# EAGLE design JTagAdapter (EAGLE 5.09)
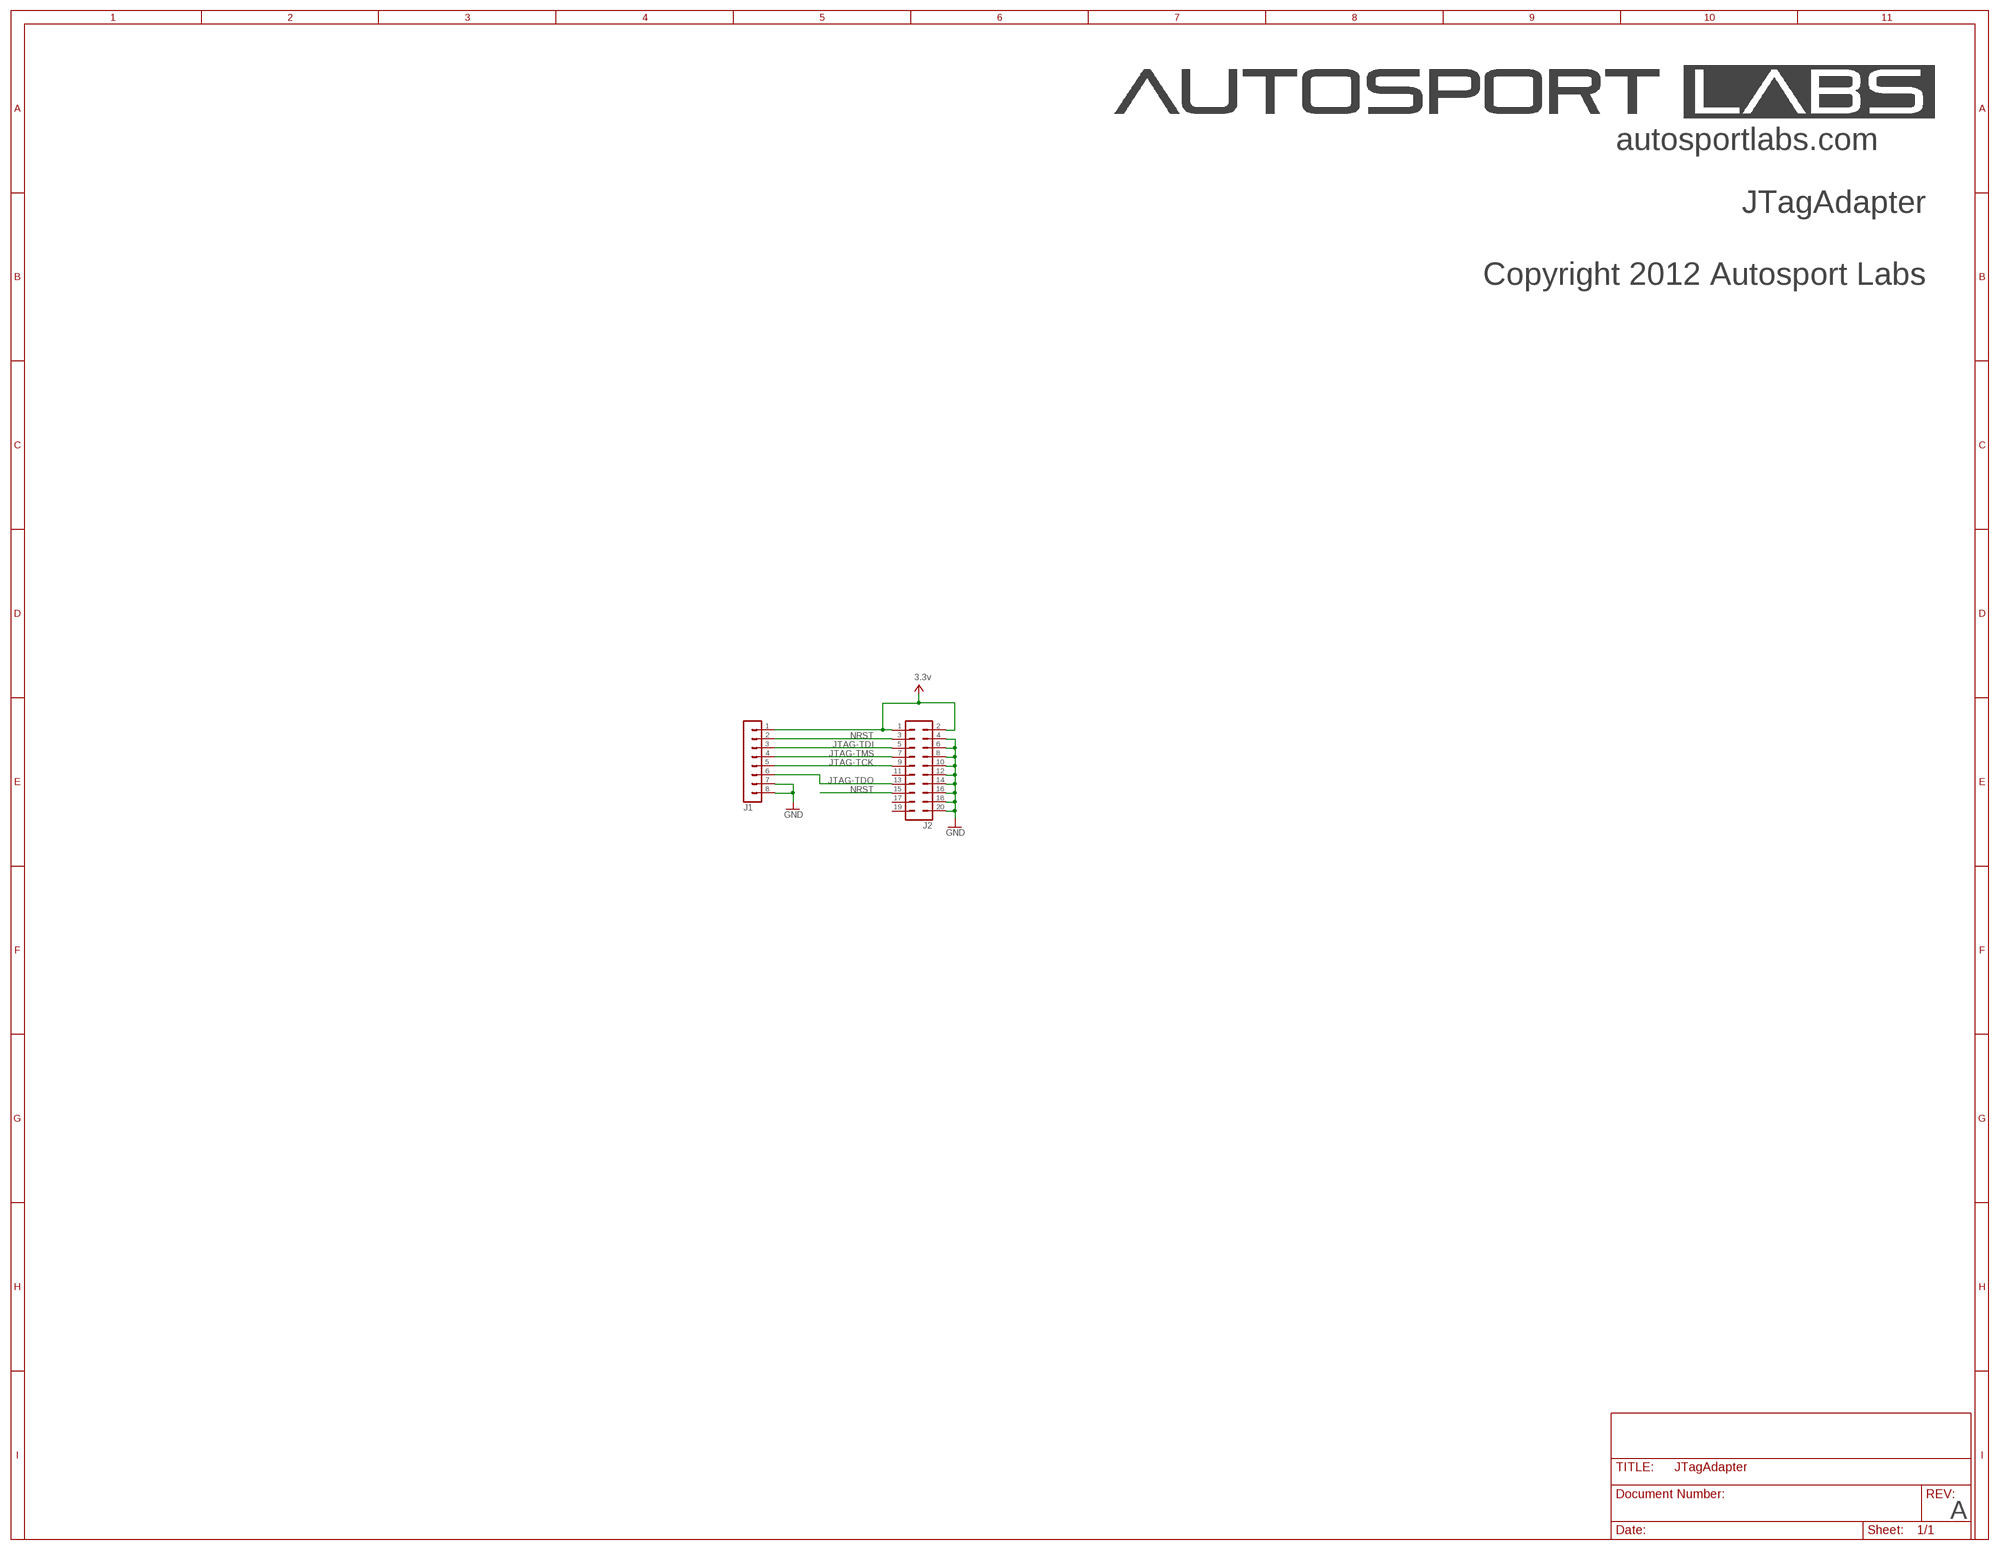
[diagram p0: schematic, sheet 1]

## Parts
J1  MA08-1  [MA08-1]
J2  MA10-2  [MA10-2]

## Nets
GND: J1.7 J1.8 J2.4 J2.6 J2.8 J2.10 J2.12 J2.14 J2.16 J2.18 J2.20
JTAG-TCK: J1.5 J2.9
JTAG-TDI: J1.3 J2.5
JTAG-TDO: J1.6 J2.13
JTAG-TMS: J1.4 J2.7
NRST: J1.2 J2.3 J2.15
V+: J1.1 J2.1 J2.2 ; supply symbol labelled 3.3v
Unconnected: J2.11 J2.17 J2.19

## Notes on the sheet
- autosportlabs.com
- JTagAdapter
- Copyright 2012 Autosport Labs
- A

## Library data of the parts
J1 = con-lstb:MA08-1: PIN HEADER
J2 = con-lstb:MA10-2: PIN HEADER

## Board
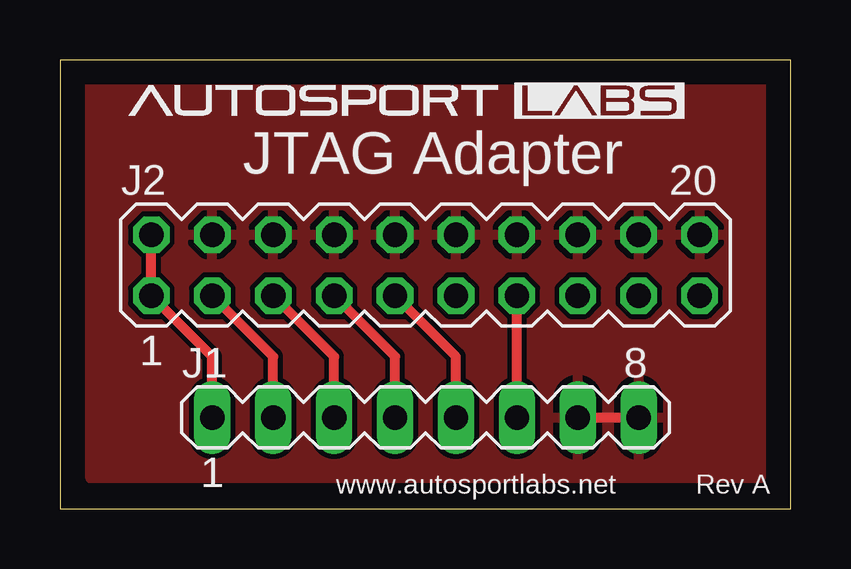
[diagram p1: board, top side]
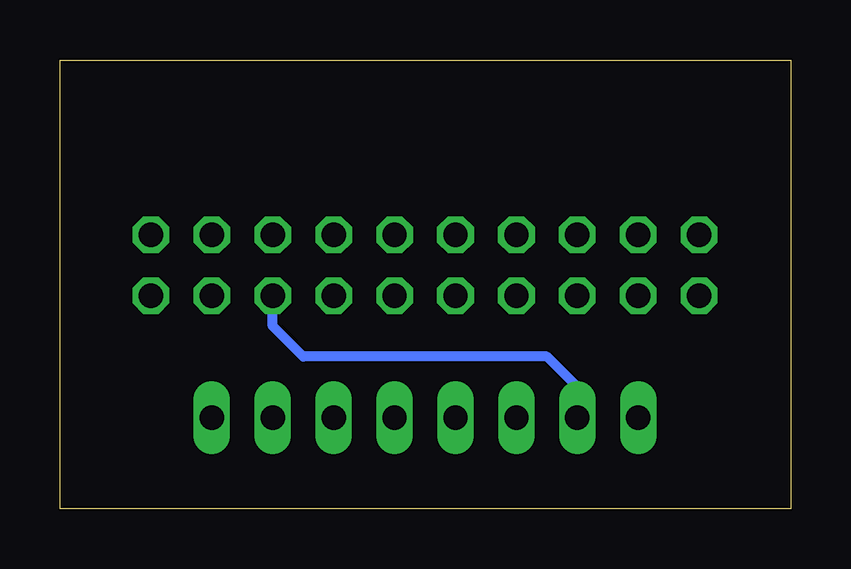
[diagram p2: board, bottom side, seen from below]

Size 30.46 x 18.72 mm. Coordinates in mm from the lower left corner, seen from the top.
Outline: 0,0 30.46,0 30.46,18.72 0,18.72 0,0
Copper layers (1*16): Top 0.035mm / dielectric 1.5mm / Bottom 0.035mm
Design rules "default": minimum track width 10mil, minimum drill 24mil, track to track 8mil, track to pad 8mil, pad to pad 8mil, via to via 8mil, smd to smd 8mil, copper to edge 40mil, drill to drill 8mil, minimum pad ring 10mil, minimum via ring 8mil, stop-mask expansion 4mil, vias tented up to drill 0mil, thermal gap 10mil

### Footprints (pad centres in the part's own frame; a part is rotated, then mirrored left to right if it is on the bottom)
MA08-1 = drill 1.016 long: 1 -8.89,0; 2 -6.35,0; 3 -3.81,0; 4 -1.27,0; 5 1.27,0; 6 3.81,0; 7 6.35,0; 8 8.89,0
MA10-2 = drill 1.016 octagon: 1 -11.43,-1.27; 2 -11.43,1.27; 3 -8.89,-1.27; 4 -8.89,1.27; 5 -6.35,-1.27; 6 -6.35,1.27; 7 -3.81,-1.27; 8 -3.81,1.27; 9 -1.27,-1.27; 10 -1.27,1.27; 11 1.27,-1.27; 12 1.27,1.27; 13 3.81,-1.27; 14 3.81,1.27; 15 6.35,-1.27; 16 6.35,1.27; 17 8.89,-1.27; 18 8.89,1.27; 19 11.43,-1.27; 20 11.43,1.27

### Placement (x,y rotation side)
J1  15.24,3.81 0 top
J2  15.24,10.16 0 top

### Tracks (layer width: path | path; a pad name or v marks a point on that pad's centre or on a via)
GND
  Top 0.406: J1.7 J1.8
  pour Top: 1.27,17.78 29.21,17.78 29.21,1.27 1.27,1.27
JTAG-TCK
  Top 0.406: J1.5 16.51,6.35 J2.9
JTAG-TDI
  Top 0.406: J1.3 11.43,6.35 J2.5
JTAG-TDO
  Top 0.406: J1.6 J2.13
JTAG-TMS
  Top 0.406: J1.4 13.97,6.35 J2.7
NRST
  Top 0.406: J1.2 8.89,6.35 J2.3
  Bottom 0.406: J2.15 21.59,7.62 20.32,6.35 10.16,6.35 8.89,5.08 J1.2
V+
  Top 0.406: J1.1 6.35,6.35 J2.1 J2.2

### Text on the board
tPlace: JTAG Adapter | www.autosportlabs.net | Rev A